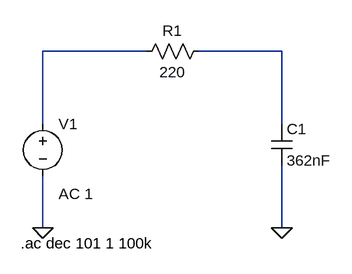
[diagram p0: schematic Low Pass Filter.asc]
Low Pass Filter.asc, the LTspice schematic file:
Version 4
SHEET 1 880 680
WIRE 128 16 -32 16
WIRE 336 16 208 16
WIRE -32 128 -32 16
WIRE 336 128 336 16
WIRE -32 288 -32 208
WIRE 336 288 336 192
FLAG -32 288 0
FLAG 336 288 0
SYMBOL voltage -32 112 R0
WINDOW 123 24 124 Left 2
WINDOW 39 0 0 Left 0
SYMATTR InstName V1
SYMATTR Value ""
SYMATTR Value2 AC 1
SYMBOL res 224 0 R90
WINDOW 0 0 56 VBottom 2
WINDOW 3 32 56 VTop 2
SYMATTR InstName R1
SYMATTR Value 220
SYMBOL cap 320 128 R0
SYMATTR InstName C1
SYMATTR Value 362nF
TEXT -66 312 Left 2 !.ac dec 101 1 100k

The netlist it stands for:
* Low Pass Filter.asc
V1 N001 0 AC 1
R1 N002 N001 220
C1 N002 0 362nF
.ac dec 101 1 100k
.backanno
.end